# EAGLE design Pyboard XBee Skin (EAGLE 7.5.0)
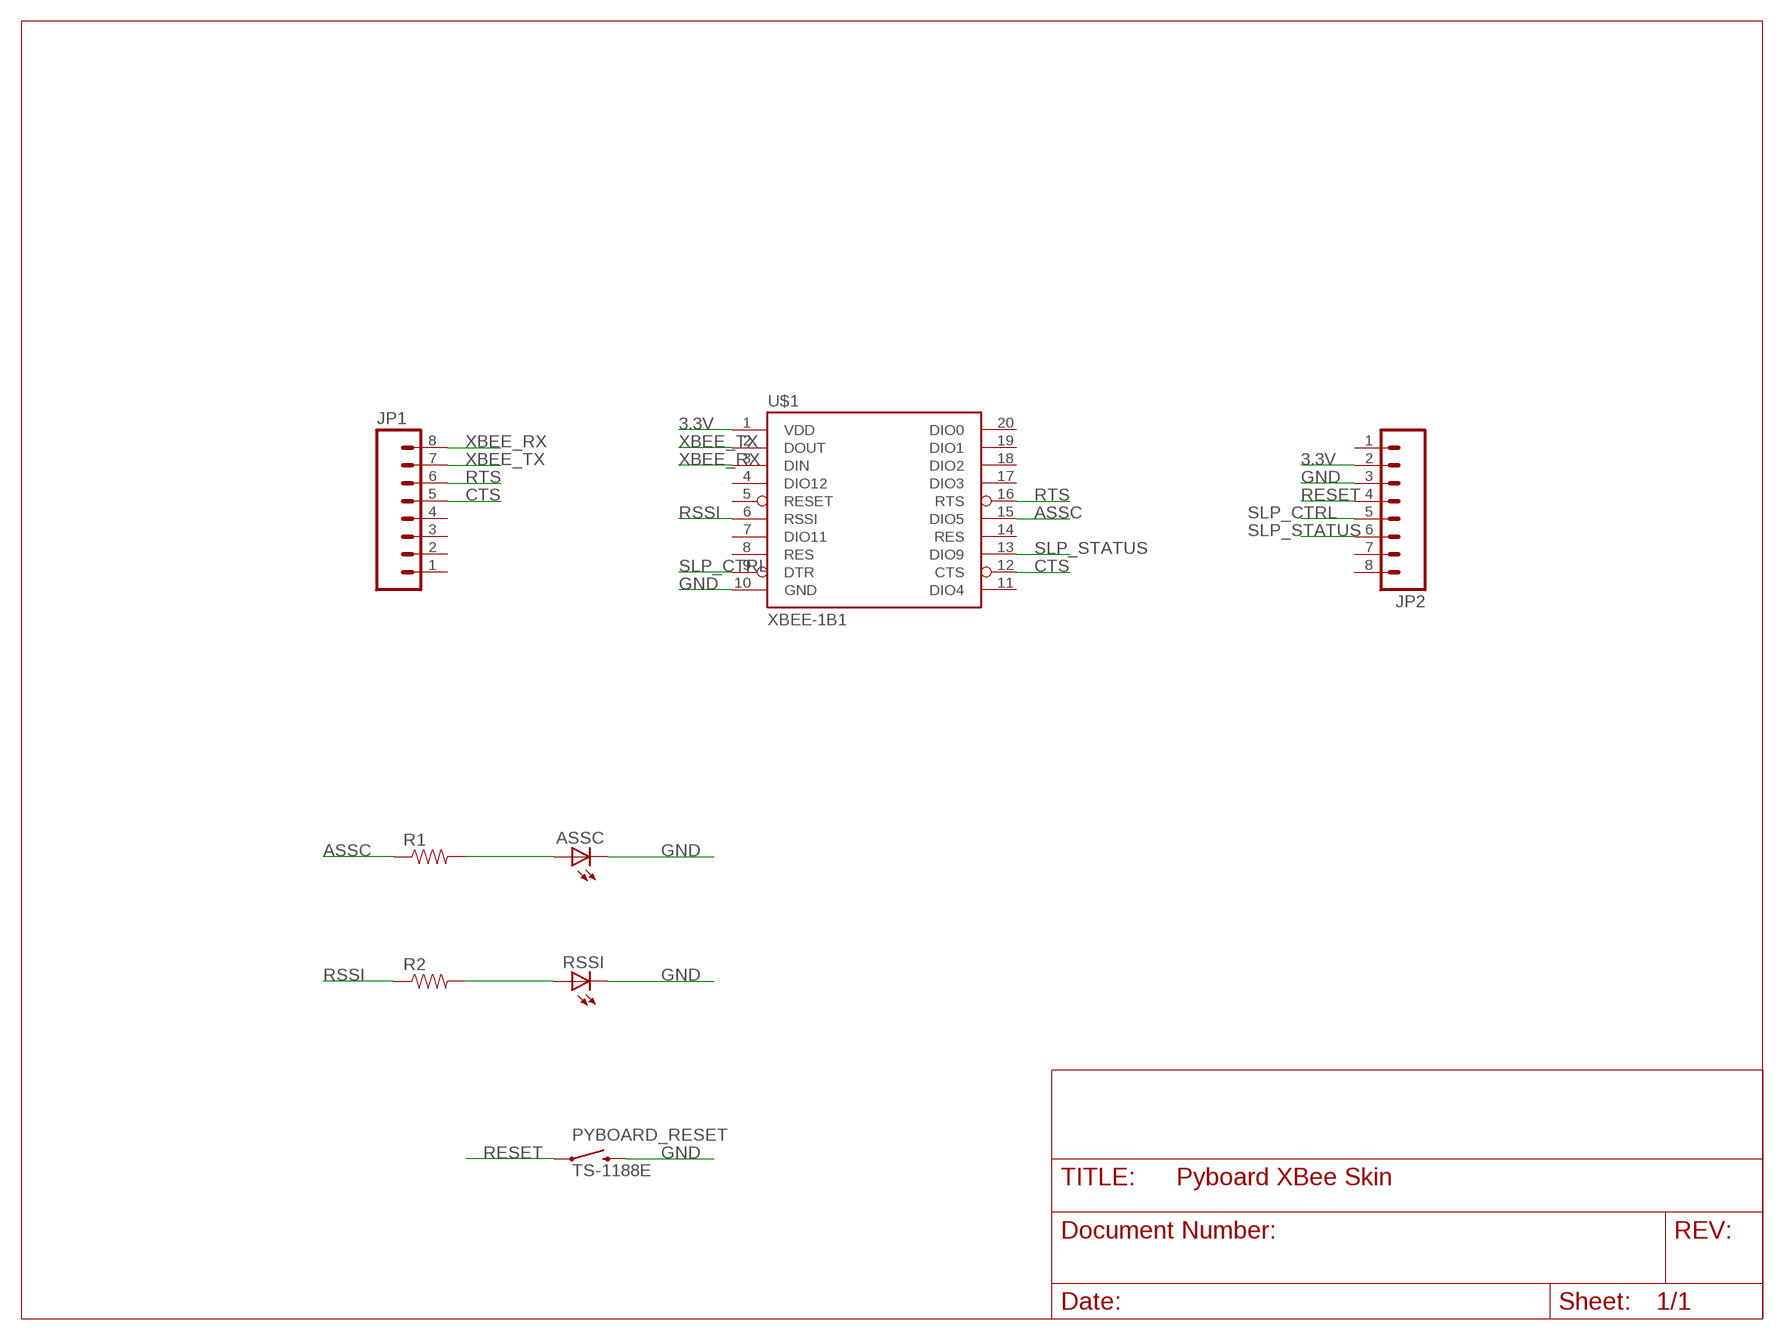
[diagram p0: schematic, sheet 1]

## Parts
ASSC  LED0603  [LED-0603]
JP1  M081X08  [1X08]
JP2  M081X08  [1X08]
PYBOARD_RESET  TS-1188E  SWITCH-MOMENTARY-2SMD  [TACTILE_SWITCH_SMD]
R1  RESISTOR0603-RES  [0603-RES]
R2  RESISTOR0603-RES  [0603-RES]
RSSI  LED0603  [LED-0603]
U$1  XBEE-1B1  [XBEE-1]

## Nets
3.3V: JP2.2 U$1.1(VDD)
ASSC: R1.1 U$1.15(DIO5)
CTS: JP1.5 U$1.12(CTS)
GND: ASSC.C JP2.3 PYBOARD_RESET.3 RSSI.C U$1.10(GND)
N$1: R2.2 RSSI.A
N$3: ASSC.A R1.2
RESET: JP2.4 PYBOARD_RESET.1
RSSI: R2.1 U$1.6(RSSI)
RTS: JP1.6 U$1.16(RTS)
SLP_CTRL: JP2.5 U$1.9(DTR)
SLP_STATUS: JP2.6 U$1.13(DIO9)
XBEE_RX: JP1.8 U$1.3(DIN)
XBEE_TX: JP1.7 U$1.2(DOUT)
Unconnected: JP1.1 JP1.2 JP1.3 JP1.4 JP2.1 JP2.7 JP2.8 U$1.4(DIO12) U$1.5(RESET) U$1.7(DIO11) U$1.8(RES) U$1.11(DIO4) U$1.14(RES) U$1.17(DIO3) U$1.18(DIO2) U$1.19(DIO1) U$1.20(DIO0)

## Library data of the parts
ASSC RSSI = SparkFun-LED:LED: LEDs Standard schematic elements and footprints for 5mm, 3mm, 1206, and 0603 sized LEDs. 5mm - Spark Fun Electronics SKU : COM-00529 (and others)
JP1 JP2 = SparkFun-Connectors:M08: Header 8 Standard 8-pin 0.1" header. Use with straight break away headers (SKU : PRT-00116), right angle break away headers (PRT-00553), swiss pins (PRT-00743), machine pins (PRT-00117), and female headers (PRT-00115).
PYBOARD_RESET = SparkFun-Electromechanical:SWITCH-MOMENTARY-2: Various NO switches- pushbuttons, reed, etc
R1 R2 = SparkFun-Passives:RESISTOR: Resistor Basic schematic elements and footprints for 0603, 1206, and PTH resistors.
U$1 = SparkFun-RF:XBEE-1: Xbee module footprints SMT header is CONN-09042.

## Board
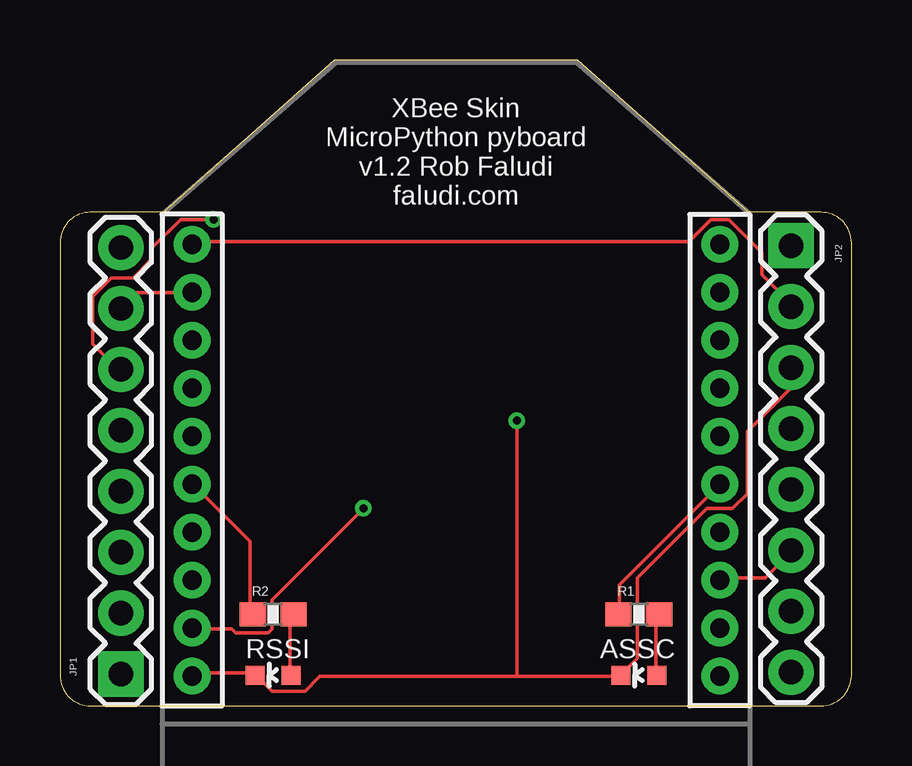
[diagram p1: board, top side]
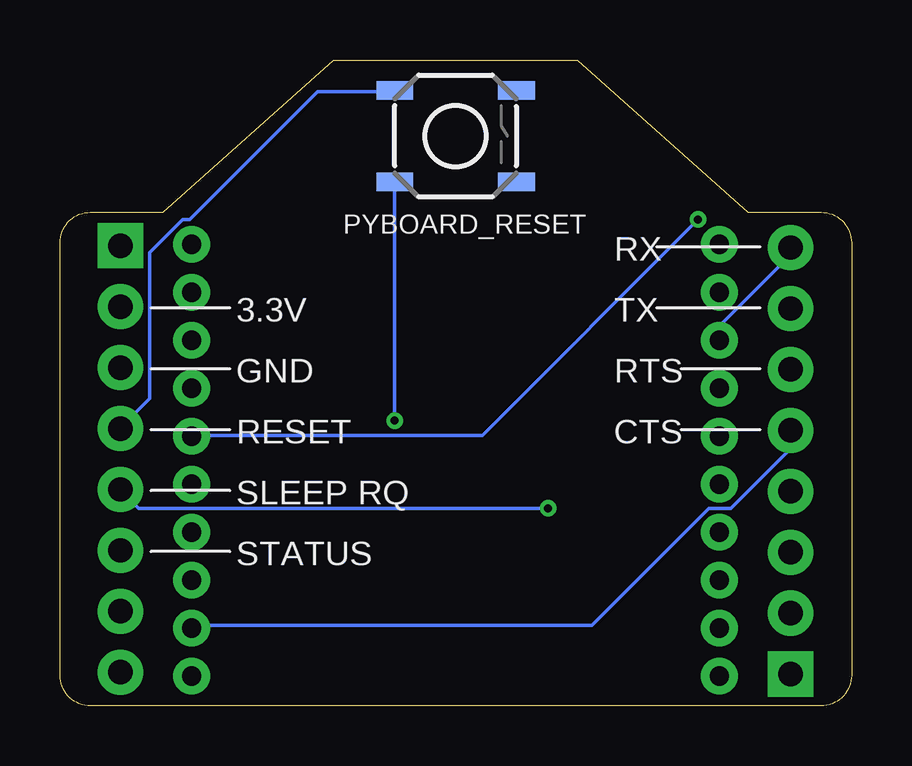
[diagram p2: board, bottom side, seen from below]

Size 33 x 26.92 mm. Coordinates in mm from the lower left corner, seen from the top.
Outline: 0,19.3 0,1.27 arc90 1.27,0 31.73,0 arc90 33,1.27 33,19.3 arc90 31.73,20.57 28.7,20.57 21.59,26.92 11.43,26.92 4.32,20.57 1.27,20.57 arc90 0,19.3
Copper layers (1*16): Top 0.0356mm / dielectric 1.5011mm / Bottom 0.0356mm
Design rules "oshpark-2layer": minimum track width 6mil, minimum drill 13mil, track to track 6mil, track to pad 6mil, pad to pad 6mil, via to via 6mil, smd to smd 6mil, copper to edge 15mil, drill to drill 6mil, minimum pad ring 7mil, minimum via ring 7mil, stop-mask expansion 2.5mil, vias tented up to drill 0mil, thermal gap 10mil

### Footprints (pad centres in the part's own frame; a part is rotated, then mirrored left to right if it is on the bottom)
LED-0603 = smd 0.8 x 0.8: A 0,-0.75; C 0,0.75
1X08 = drill 1.016 pad 1.88 square: 1 0,0 | drill 1.016 pad 1.88: 2 2.54,0; 3 5.08,0; 4 7.62,0; 5 10.16,0; 6 12.7,0; 7 15.24,0; 8 17.78,0
TACTILE_SWITCH_SMD = smd 1.524 x 0.762: 1 -2.54,1.905; 2 2.54,1.905; 3 -2.54,-1.905; 4 2.54,-1.905
0603-RES = smd 1.1 x 1: 1 -0.85,0; 2 0.85,0
XBEE-1 = drill 0.8 pad 1.524: 1 -11,20; 2 -11,18; 3 -11,16; 4 -11,14; 5 -11,12; 6 -11,10; 7 -11,8; 8 -11,6; 9 -11,4; 10 -11,2; 11 11,2; 12 11,4; 13 11,6; 14 11,8; 15 11,10; 16 11,12; 17 11,14; 18 11,16; 19 11,18; 20 11,20

### Placement (x,y rotation side)
ASSC  24.13,1.27 90 top
JP1  2.54,1.32 90 top
JP2  30.48,19.18 270 top
PYBOARD_RESET  16.51,23.75 0 bottom
R1  24.13,3.81 0 top
R2  8.89,3.81 0 top
RSSI  8.89,1.27 90 top
U$1  16.51,-0.76 0 top

### Tracks (layer width: path | path; a pad name or v marks a point on that pad's centre or on a via)
3.3V
  Top 0.152: U$1.1 5.64,19.36 26.21,19.36 27.13,20.27 27.89,20.27 29.26,18.9 29.26,17.98 30.48,16.76 JP2.2
ASSC
  Top 0.152: R1.1 23.32,3.81 23.32,5.03 27.43,9.14 U$1.15
CTS
  Bottom 0.152: U$1.12 27.43,3.35 10.82,3.35 5.94,8.23 5.03,8.23 2.59,10.67 2.59,11.43 JP1.5
GND  (via drill 0.33)
  Top 0.152: U$1.10 5.64,1.37 8.08,1.37 RSSI.C 8.23,1.22 8.84,0.61 10.21,0.61 10.82,1.22 19.05,1.22 | 19.05,1.22 23.32,1.22 ASSC.C 23.47,1.37 24.08,1.98 24.08,5.33 26.98,8.23 28.04,8.23 28.65,8.84 28.65,11.43 30.48,13.26 JP2.3 | 19.05,1.22 v19.05,11.89
  Bottom 0.152: v19.05,11.89 PYBOARD_RESET.3
N$1
  Top 0.152: RSSI.A 9.6,1.37 9.6,3.81 R2.2
N$3
  Top 0.152: ASSC.A 24.84,1.37 24.84,3.81 R1.2
RESET
  Bottom 0.152: PYBOARD_RESET.1 19.05,25.6 22.25,25.6 27.58,20.27 27.89,20.27 29.26,18.9 29.26,12.8 30.48,11.58 JP2.4
RSSI
  Top 0.152: R2.1 7.92,3.81 7.92,6.86 5.64,9.14 U$1.6
RTS  (via drill 0.33)
  Top 0.152: v6.4,20.27 5.03,20.27 3.81,19.05 3.81,18.59 3.05,17.83 2.13,17.83 1.37,17.07 1.37,15.09 2.44,14.02 JP1.6
  Bottom 0.152: v6.4,20.27 15.39,11.28 27.43,11.28 U$1.16
SLP_CTRL  (via drill 0.33)
  Top 0.152: v12.65,8.23 8.84,4.42 8.84,3.2 8.69,3.05 7.32,3.05 7.16,3.2 5.64,3.2 U$1.9
  Bottom 0.152: v12.65,8.23 29.72,8.23 30.48,8.99 JP2.5
SLP_STATUS
  Top 0.152: U$1.13 27.58,5.33 29.41,5.33 30.48,6.4 JP2.6
XBEE_RX
  Bottom 0.152: U$1.3 5.49,15.24 5.49,15.85 2.59,18.75 2.59,19.05 JP1.8
XBEE_TX
  Top 0.152: JP1.7 3.2,17.22 5.49,17.22 U$1.2

### Text on the board
tNames: XBee Skin / MicroPython pyboard / v1.2 Rob Faludi / faludi.com
bNames: RX | TX | 3.3V | RTS | GND | CTS | RESET | SLEEP RQ | STATUS